# Altium schematic sheet ZYNQ.SchDoc
size A4
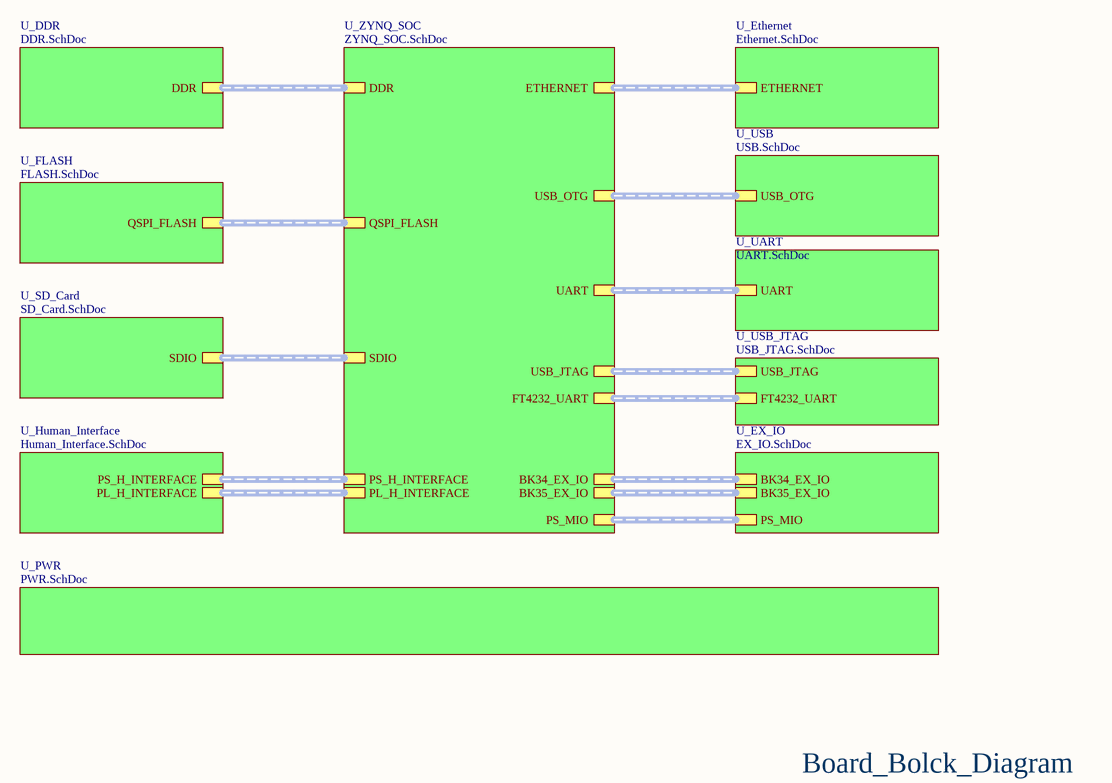
[diagram p0: ZYNQ.SchDoc]

## Sub-sheets
U_DDR = DDR.SchDoc: DDR (harness DDR)
U_Ethernet = Ethernet.SchDoc: ETHERNET (harness ETHERNET)
U_EX_IO = EX_IO.SchDoc: PS_MIO (harness PS_MIO), BK35_EX_IO (harness BK35_EX_IO), BK34_EX_IO (harness BK34_EX_IO)
U_FLASH = FLASH.SchDoc: QSPI_FLASH (harness QSPI_FLASH)
U_Human_Interface = Human_Interface.SchDoc: PS_H_INTERFACE (harness PS_H_INTERFACE), PL_H_INTERFACE (harness PL_H_INTERFACE)
U_PWR = PWR.SchDoc: no entries
U_SD_Card = SD_Card.SchDoc: SDIO (harness SDIO)
U_UART = UART.SchDoc: UART (harness UART)
U_USB = USB.SchDoc: USB_OTG (harness USB_OTG)
U_USB_JTAG = USB_JTAG.SchDoc: FT4232_UART (harness FT4232_UART), USB_JTAG (harness USB_JTAG)
U_ZYNQ_SOC = ZYNQ_SOC.SchDoc: QSPI_FLASH, DDR, PL_H_INTERFACE, UART, PS_H_INTERFACE, SDIO, BK34_EX_IO, PS_MIO, BK35_EX_IO, ETHERNET, USB_OTG, USB_JTAG, FT4232_UART

## Buses and harness runs
harness sheet U_DDR/DDR = sheet U_ZYNQ_SOC/DDR
harness sheet U_Ethernet/ETHERNET = sheet U_ZYNQ_SOC/ETHERNET
harness sheet U_EX_IO/BK34_EX_IO = sheet U_ZYNQ_SOC/BK34_EX_IO
harness sheet U_EX_IO/BK35_EX_IO = sheet U_ZYNQ_SOC/BK35_EX_IO
harness sheet U_EX_IO/PS_MIO = sheet U_ZYNQ_SOC/PS_MIO
harness sheet U_FLASH/QSPI_FLASH = sheet U_ZYNQ_SOC/QSPI_FLASH
harness sheet U_Human_Interface/PL_H_INTERFACE = sheet U_ZYNQ_SOC/PL_H_INTERFACE
harness sheet U_Human_Interface/PS_H_INTERFACE = sheet U_ZYNQ_SOC/PS_H_INTERFACE
harness sheet U_SD_Card/SDIO = sheet U_ZYNQ_SOC/SDIO
harness sheet U_UART/UART = sheet U_ZYNQ_SOC/UART
harness sheet U_USB/USB_OTG = sheet U_ZYNQ_SOC/USB_OTG
harness sheet U_USB_JTAG/FT4232_UART = sheet U_ZYNQ_SOC/FT4232_UART
harness sheet U_USB_JTAG/USB_JTAG = sheet U_ZYNQ_SOC/USB_JTAG

## Notes on the sheet
- Board_Bolck_Diagram